# Altium schematic sheet Power.SchDoc
size A4; SheetNumber: 5; SheetTotal: 7
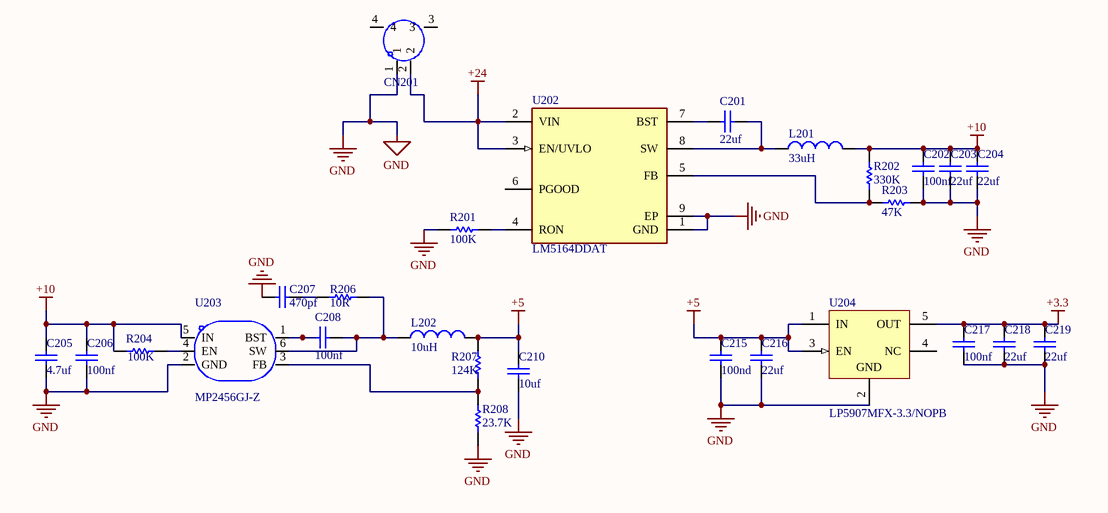
[diagram p0: Power.SchDoc]

## Parts
C201  22uf  [CAPC1608X90X35NL10T15]
C202  100nf  [CAPC0805(2012)145_N]
C203  22uf  [CAPC0805(2012)145_N]
C204  22uf  [CAPC0805(2012)145_N]
C205  4.7uf  [CAPC1608X87X35ML15T15]
C206  100nf  [CAPC1608X87X35ML15T15]
C207  470pf  [CAPC1608X87X35ML15T15]
C208  100nf  [CAPC1608X87X35ML15T15]
C210  10uf  [CAPC1608X87X35ML15T15]
C215  100nd  [CAPC1608X87X35ML15T15]
C216  22uf  [CAPC1608X87X35ML15T15]
C217  100nf  [CAPC1608X87X35ML15T15]
C218  22uf  [CAPC1608X87X35ML15T15]
C219  22uf  [CAPC1608X87X35ML15T15]
CN201  XT30PW-M  [CONN-TH_XT30PW-M]  (value not drawn)
L201  33uH  [TAYO-IND0315_V]
L202  10uH  [TAYO-IND0315_V]
R201  100K  [RESC1608X55X25ML10T15]
R202  330K  [RESC2013X50X30LL20T20]
R203  47K  [RESC2013X50X30LL20T20]
R204  100K  [RESC1608X55X25ML10T15]
R206  10R  [RESC1608X55X25ML10T15]
R207  124K  [RESC1608X55X25ML10T15]
R208  23.7K  [RESC1608X55X25ML10T15]
U202  LM5164DDAT  [FP-DDA0008E-MFG]
U203  MP2456GJ-Z  [TSOT-23-6_L2.9-W1.6-P0.95-LS2.8-BR]
U204  LP5907MFX-3.3/NOPB  [DBV0005A_L]

## Nets
+3.3: C217.2 C218.2 C219.2 U204.5(OUT)
+5: C210.2 C215.2 C216.2 L202.2 R207.1 U204.1(IN) U204.3(EN)
+10: C202.2 C203.2 C204.2 C205.2 C206.2 L201.2 R202.2 R204.1 U203.5(IN)
+24: CN201.2 U202.2(VIN) U202.3(EN/UVLO)
GND: C202.1 C203.1 C204.1 C205.1 C206.1 C207.2 C210.1 C215.1 C216.1 C217.1 C218.1 C219.1 CN201.1 R201.1 R203.2 R208.1 U202.1(GND) U202.9(EP) U203.2(GND) U204.2(GND)
NetC201_1: C201.1 U202.7(BST)
NetC201_2: C201.2 L201.1 U202.8(SW)
NetC207_1: C207.1 R206.1
NetC208_1: C208.1 L202.1 R206.2 U203.6(SW)
NetC208_2: C208.2 U203.1(BST)
NetR201_2: R201.2 U202.4(RON)
NetR202_1: R202.1 R203.1 U202.5(FB)
NetR204_2: R204.2 U203.4(EN)
NetR207_2: R207.2 R208.2 U203.3(FB)

Not connected (* = marked no-connect by the designer): CN201 3 4; U202 6(PGOOD); U204 4(NC)

## Library data of the parts
C201 = CMP-2006-02792-1: Part Number: GRM188R60J106ME47D; Manufacturer: Murata
C202-C204 = CMP-1036-04552-1: CAP 220nF 50V ±10% 0805 (2012 Metric) Thickness 1.45mm SMD; Tolerance: Â±10%; Case-Metric: 2012; Case-EIA: 0805; Value: 220nF; Max Thickness: 1.45 mm; Technology: SMT; Rated Voltage: 50 V
C205-C208 C210 C215-C219 = CMP-2006-03046-1: Manufacturer: Kemet; Part Number: C0603C103K5RAC7867
CN201 = XT30PW-M: Manufacturer: AMASS(艾迈斯); Add into BOM: yes; Symbol: XT30PW-M; Device: XT30PW-M; LCSC Part Name: XT30PW-M公头; Supplier Part: C431092; Manufacturer Part: XT30PW-M; Supplier Footprint: Through Hole; JLCPCB Part Class: Extended Part; Datasheet: https://atta.szlcsc.com/upload/public/pdf/source/20220222/6A9F22F7850E25B33E1BE430ADF8560B.pdf; Supplier: LCSC; Convert to PCB: yes
L201 L202 = CMP-0569-00001-2: SMD Power Inductor, 2.2 uH, +/- 20%, 3 x 3 x 1.5 mm, -25 to 120 degC, Pb-Free, Tape and Reel; Manufacturer: Taiyo Yuden; PartNumber: NR3015T2R2M; Inductance: 2.2 uH (+/-20%); Rated Current-Temperature Rise Current: 1500 mA; DC Resistance (max): 0.072 Ohm; Rated Current-Saturation Current: 1480 mA; Inductance Measuring Frequency: 100 kHz; Self-Resonant Frequency (min): 64 MHz; Avg. of DC. Resistance: 0.06 Ohm; Soldering Method: Reflow; Temperature Range: -25 to 120 degC; ComponentLink1Description: Manufacturer URL; Mounting Technology: Surface Mount; Halogen Free: TRUE; ComponentLink1URL: www.yuden.co.jp; Packing: Tape and Reel; DatasheetVersion: 1/11/2013; PackageDescription: 2-Pin SMT Inductor, Body 3 x 3 mm; ComponentLink2URL: http://www.yuden.co.jp/ut/product/category/inductor/NR3015T2R2M.pdf; RoHS Compliance: TRUE; PackageReference: IND3015; ComponentLink2Description: Datasheet; Case Size: 3015
R201 R204 R206-R208 = CMP-2100-03667-1: Chip Resistor, 0 Ohm, +/- 5%, 0.1 W, -55 to 155 degC, 0603 (1608 Metric), RoHS, Tape and Reel; Manufacturer: Yageo; Temperature Coefficient: 200ppm/degreesC; Voltage Rating: 50V; Power Rating: 100mW; Resistance: 0mOhm; Width: 0.8mm; Max Operating Temperature: 155degC; Tolerance: 5%; Package Reference: 0603; Height: 0.45mm; Depth: 0.8mm; Package Description: 2-Pin Surface Mount Device, Body 1.6 x 0.8 mm; Termination: SMD/SMT; Package Quantity: 5000; Case/Package: 0603; Case Code (Imperial): 0603; Radiation Hardening: No; Number of Pins: 2; Length: 1.6mm; Lead Free: LeadFree; Voltage Rating (DC): 50V; Military Standard: Not; Datasheet URL: http://www.yageo.com/NewPortal/yageodocoutput?fileName=/pdf/R-Chip/PYu-RC_Group_51_RoHS_L_5.pdf; Manufacturer URL: http://www.yageo.com/; Packaging: TapeandReel; Case Code (Metric): 1608; Min Operating Temperature: -55degC; Composition: ThickFilm; RoHSCompliant: true; Contact Plating: Tin; Datasheet Version: Rev. 5, 10/2016; REACH SVHC: NoSVHC
R202 R203 = CMP-2001-04896-1: Manufacturer: Vishay Dale; Part Number: CRCW08050000Z0EA
U202 = CMP-04918-000052-1: IC REG BUCK ADJUSTABLE 1A 8SOPWR; Manufacturer: Texas Instruments; Nominal Supply Current: 600uA; Switching Frequency: 1000kHz; Number Of Outputs: 1; Min Supply Voltage: 6V; Max Junction Temp: +150°C; Max Duty Cycle: 100%; Output Voltage: 1.2-90V; Output Type: AdjustableProgrammable; Max Supply Voltage: 100V; Standoff Height: 0mm; Device Class L1: Integrated Circuits (ICs); Temperature Range High: +150°C; Lead Free: Yes; Temperature: -40°C to +150°C; Category: IC; Device Class L2: Power Management ICs; Digikey Description: IC REG BUCK ADJUSTABLE 1A 8SOPWR; Mouser Description: 6-V to 100-V input, 1-A synchronous buck DC-DC converter with ultra-low IQ 8-SO PowerPAD -40 to 150; Temperature Range Low: -40°C; Octopart: https://octopart.com/lm5164ddat-texas+instruments-96785745; ComponentLink2Description: Datasheet; Manufacturer Part Number: LM5164DDAT; Device Class L3: Voltage Regulators - Switching; Package: DDA0008E; RoHS: TRUE; Ipc Land Pattern Name: SOIC127P600X170-8; Output Current: 1A; Automotive: No; ComponentLink2URL: http://www.ti.com/lit/ds/symlink/lm5164.pdf; Height: 1.7mm; Switching Topology: Buck
U203 = MP2456GJ-Z: Add into BOM: yes; Symbol: MP2456GJ-Z; Device: MP2456GJ-Z; LCSC Part Name: MP2456GJ-Z; Supplier Part: C88045; Manufacturer Part: MP2456GJ-Z; Supplier Footprint: TSOT-23-6; JLCPCB Part Class: Extended Part; Supplier: LCSC; Convert to PCB: yes; Output Type: -; Number of Outputs: -; Voltage - Input (Min): -; Voltage - Input (Max): -; Voltage - Output (Min/Fixed): -; Voltage - Output (Max): -; Current - Output: -; Frequency - Switching: -; Function: -; Synchronous Rectifier: -; Output Configuration: -; Topology: -
U204 = CMP-2000-07464-1: Ultra-Low-Noise, Low-IQ LDO, 0.25 A, Fixed 3.3 V Output, 2.2 to 5.5 V Input, -40 to 125 degC, 5-Pin SOT-23 (DBV), Green (RoHS & no Sb/Br), Tape and Reel; Manufacturer: Texas Instruments; Max Output Current: 250mA; Max Input Voltage: 5.5V; Dropout Voltage: 250mV; Number of Regulators: 1; Nominal Output Voltage: 3.3V; Output Voltage Accuracy: 2%; Polarity: Positive; Min Input Voltage: 2.2V; Package Version: 4073253-4/N, 12/2014; Quiescent Current: 425uA; Power Supply Rejection Ratio (PSRR): 82dB; Case\/Package: SOT-23; Lead Free: LeadFree; Package Reference: DBV5; Output Current: 250mA; Package Description: 5-Pin Small Outline Transistor, Body 2.9 x 1.6 mm, Pitch 0.95 mm; Max Operating Temperature: 125degC; Mounting Technology: SurfaceMount; Number of Pins: 5; Mount: SurfaceMount; Manufacturer URL: http://www.ti.com/; Accuracy: 2%; Package URL: http://www.ti.com/lit/ml/mpds018l/mpds018l.pdf; Output Voltage: 3.3V; Radiation Hardening: No; Number of Outputs: 1; Packaging: TapeandReel; RoHSCompliant: true; Min Operating Temperature: -40degC; Datasheet URL: http://www.ti.com/lit/ds/symlink/lp5907.pdf; Package Quantity: 3000; Datasheet Version: Rev. L, 09/2016; REACH SVHC: NoSVHC; Contact Plating: Tin